# Altium schematic sheet HBridgeControl.SchDoc: Sensorless BLDC interface
size A4; DocumentNumber: 1; Revision: 2; SheetNumber: 1; SheetTotal: 2
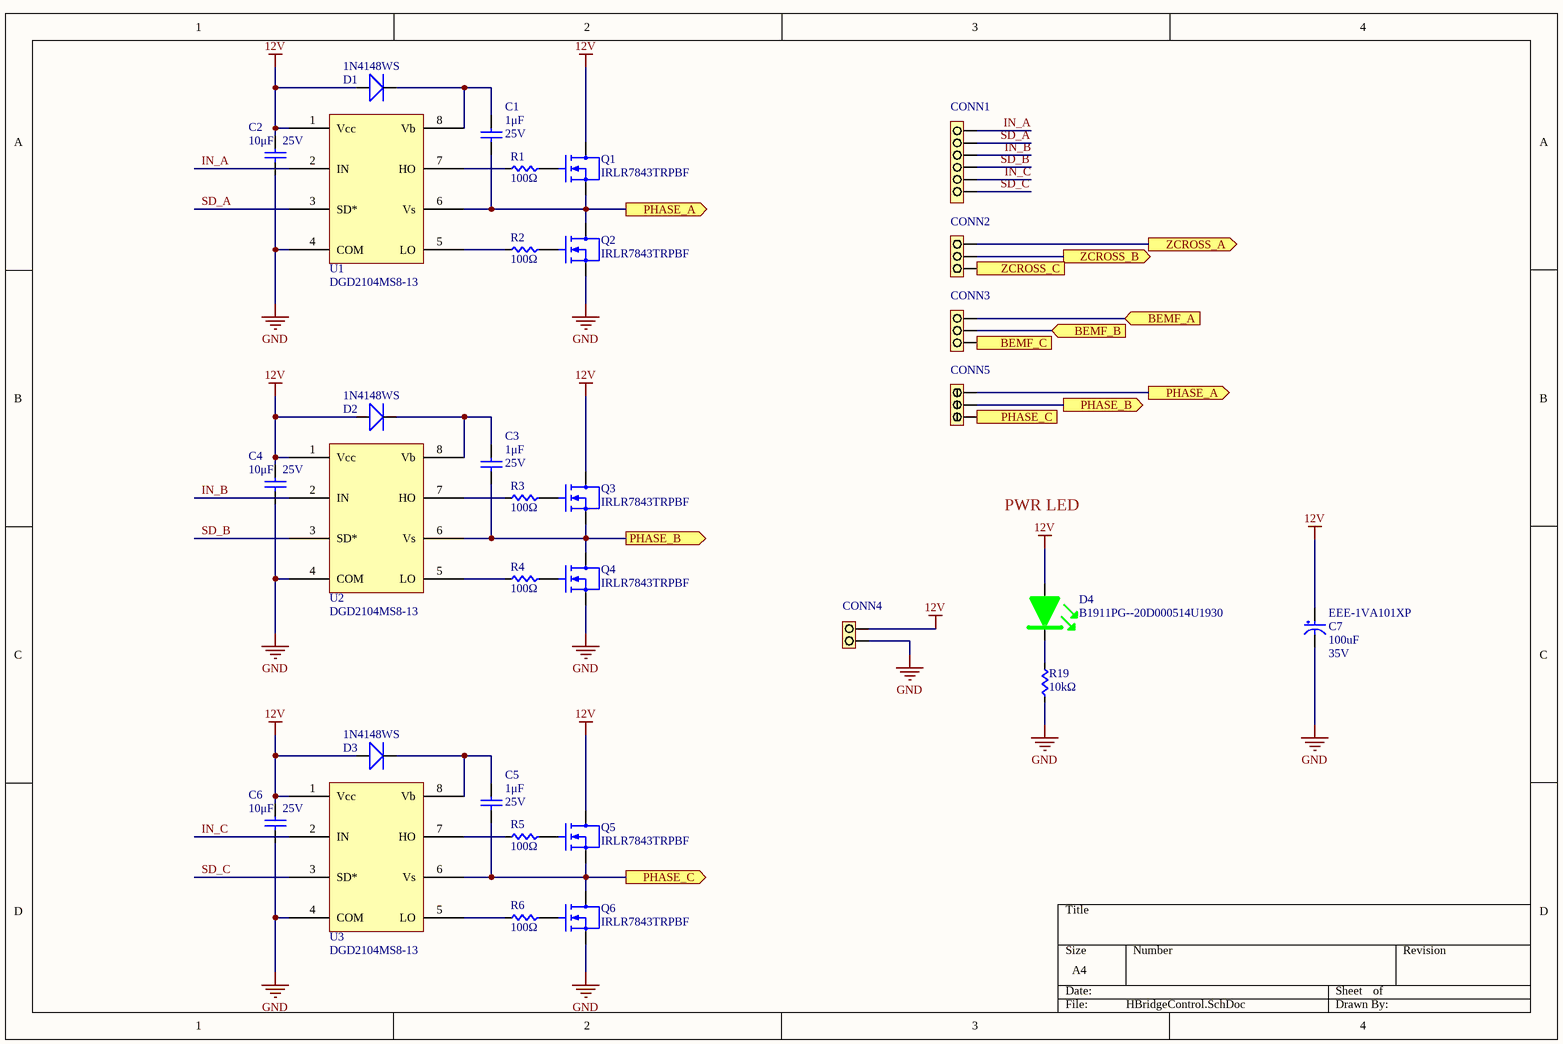
[diagram p0: HBridgeControl.SchDoc]

## Parts
C1  value 1μF  Voltage Rating: 25V  [CAP0603]  (hidden comment: GCM188R71E105KA64D)
C2  value 10μF  Voltage Rating: 25V  [CAP0603]  (hidden comment: GRM188R61E106MA73J)
C3  value 1μF  Voltage Rating: 25V  [CAP0603]  (hidden comment: GCM188R71E105KA64D)
C4  value 10μF  Voltage Rating: 25V  [CAP0603]  (hidden comment: GRM188R61E106MA73J)
C5  value 1μF  Voltage Rating: 25V  [CAP0603]  (hidden comment: GCM188R71E105KA64D)
C6  value 10μF  Voltage Rating: 25V  [CAP0603]  (hidden comment: GRM188R61E106MA73J)
C7  EEE-1VA101XP  Capacitance: 100uF  Voltage Rating: 35V  [SMD]
CONN1  MALE6PINCONN  [6POS HEADER]  (value not drawn)
CONN2  MALE3PINCONN  [3POS HEADER]  (value not drawn)
CONN3  MALE3PINCONN  [3POS HEADER]  (value not drawn)
CONN4  MALE2PINCONN  [2POS HEADER]  (value not drawn)
CONN5  SCREW3PINCONN  [SCREW3POSCONN]  (value not drawn)
D1  1N4148WS  [SOD_323]
D2  1N4148WS  [SOD_323]
D3  1N4148WS  [SOD_323]
D4  B1911PG--20D000514U1930  [LED0603]
Q1  IRLR7843TRPBF  [TO-252AA (DPAK)]
Q2  IRLR7843TRPBF  [TO-252AA (DPAK)]
Q3  IRLR7843TRPBF  [TO-252AA (DPAK)]
Q4  IRLR7843TRPBF  [TO-252AA (DPAK)]
Q5  IRLR7843TRPBF  [TO-252AA (DPAK)]
Q6  IRLR7843TRPBF  [TO-252AA (DPAK)]
R1  value 100Ω  [RES0603]  (hidden comment: RC0402JR-0710KL_1)
R2  value 100Ω  [RES0603]  (hidden comment: RC0402JR-0710KL_1)
R3  value 100Ω  [RES0603]  (hidden comment: RC0402JR-0710KL_1)
R4  value 100Ω  [RES0603]  (hidden comment: RC0402JR-0710KL_1)
R5  value 100Ω  [RES0603]  (hidden comment: RC0402JR-0710KL_1)
R6  value 100Ω  [RES0603]  (hidden comment: RC0402JR-0710KL_1)
R19  value 10kΩ  [RES0402]  (hidden comment: RC0402JR-0710KL)
U1  DGD2104MS8-13  [8SO]
U2  DGD2104MS8-13  [8SO]
U3  DGD2104MS8-13  [8SO]

## Ports
BEMF_A (in, see ZeroCrossDetection[2C]), BEMF_B (in, see ZeroCrossDetection[2C]), BEMF_C (in, see ZeroCrossDetection[2C]), PHASE_A (out, see HBridgeControl[2A], ZeroCrossDetection[1A]), PHASE_A (out, see HBridgeControl[3B], ZeroCrossDetection[1A]), PHASE_B (out, see HBridgeControl[2C], ZeroCrossDetection[1B]), PHASE_B (out, see HBridgeControl[3B], ZeroCrossDetection[1B]), PHASE_C (out, see HBridgeControl[2D], ZeroCrossDetection[1B]), PHASE_C (out, see HBridgeControl[3B], ZeroCrossDetection[1B]), ZCROSS_A (out, see ZeroCrossDetection[4A]), ZCROSS_B (out, see ZeroCrossDetection[4B]), ZCROSS_C (out, see ZeroCrossDetection[4B])

## Nets
12V: C2.1 C4.1 C6.1 C7.1 CONN4.1 D1.1 D2.1 D3.1 D4.1 Q1.2 Q3.2 Q5.2 U1.1(Vcc) U2.1(Vcc) U3.1(Vcc)
GND: C2.2 C4.2 C6.2 C7.2 CONN4.2 Q2.3 Q4.3 Q6.3 R19.2 U1.4(COM) U2.4(COM) U3.4(COM)
BEMF_A: CONN3.1 ; port BEMF_A
BEMF_B: CONN3.2 ; port BEMF_B
BEMF_C: CONN3.3 ; port BEMF_C
IN_A: CONN1.1 U1.2(IN)
IN_B: CONN1.3 U2.2(IN)
IN_C: CONN1.5 U3.2(IN)
PHASE_A: C1.2 CONN5.1 Q1.3 Q2.2 U1.6(Vs) ; port PHASE_A
PHASE_B: C3.2 CONN5.2 Q3.3 Q4.2 U2.6(Vs) ; port PHASE_B
PHASE_C: C5.2 CONN5.3 Q5.3 Q6.2 U3.6(Vs) ; port PHASE_C
SD_A: CONN1.2 U1.3(SD*)
SD_B: CONN1.4 U2.3(SD*)
SD_C: CONN1.6 U3.3(SD*)
ZCROSS_A: CONN2.1 ; port ZCROSS_A
ZCROSS_B: CONN2.2 ; port ZCROSS_B
ZCROSS_C: CONN2.3 ; port ZCROSS_C
NetC1_1: C1.1 D1.2 U1.8(Vb)
NetC3_1: C3.1 D2.2 U2.8(Vb)
NetC5_1: C5.1 D3.2 U3.8(Vb)
NetD4_2: D4.2 R19.1
NetQ1_1: Q1.1 R1.2
NetQ2_1: Q2.1 R2.2
NetQ3_1: Q3.1 R3.2
NetQ4_1: Q4.1 R4.2
NetQ5_1: Q5.1 R5.2
NetQ6_1: Q6.1 R6.2
NetR1_1: R1.1 U1.7(HO)
NetR2_1: R2.1 U1.5(LO)
NetR3_1: R3.1 U2.7(HO)
NetR4_1: R4.1 U2.5(LO)
NetR5_1: R5.1 U3.7(HO)
NetR6_1: R6.1 U3.5(LO)

## Notes on the sheet
- PWR LED

## Library data of the parts
C1 C3 C5 = GCM188R71E105KA64D: CAP CER 1UF 25V X7R 0603; Manufacturer 1: Murata; Manufacturer Part Number 1: GCM21BR71E105KA56L; Supplier 1: Digi-Key; Supplier Part Number 1: 490-4785-1-ND
C2 C4 C6 = GRM188R61E106MA73J: CAP CER 10UF 25V X5R 0603; Manufacturer 1: Murata; Manufacturer Part Number 1: GCM21BR71E105KA56L; Supplier 1: Digi-Key; Supplier Part Number 1: 490-4785-1-ND
C7 = EEE-1VA101XP: CAP ALUM 100UF 20% 35V SMD
D1-D3 = 1N4148WS: DIODE GEN PURP 75V 150MA SOD323F; Manufacturer: Onsemi; Manufacturer Part Number: 1N4148WS; Supplier: DigiKey; Supplier Part Number: 1N4148WSFSTR-ND
D4 = B1911PG--20D000514U1930: LED GREEN DIFFUSED 0603 SMD
Q1-Q6 = IRLR7843TRPBF: N-Channel 30 V 161A (Tc) 140W (Tc) Surface Mount TO-252AA (DPAK); Manufacturer: Infineon Technologies; Manufacturer Part Number: IRLR7843TRPBF; Supplier: DigiKey; Supplier Part Number: IIRLR7843PBFTR-ND
R1-R6 = RC0402JR-0710KL_1: RES 100 OHM 1% 1/10W 0603; Manufacturer 1: Stackpole Electronics Inc; Manufacturer Part Number 1: RNCP0603FTD10K0; Power Rating: 1/8W; Supplier Part Number 1: RNCP0603FTD10K0CT-ND; Supplier 1: Digi-Key
R19 = RC0402JR-0710KL: RES 10K OHM 5% 1/16W 0402; Manufacturer 1: Stackpole Electronics Inc; Manufacturer Part Number 1: RNCP0603FTD10K0; Power Rating: 1/8W; Supplier Part Number 1: RNCP0603FTD10K0CT-ND; Supplier 1: Digi-Key
U1-U3 = DGD2104MS8-13: IC GATE DRVR HALF-BRIDGE 8-SO; Manufacturer: Diodes Incorporated; Manufacturer Part Number: DGD2104MS8-13; Supplier: DigiKey; Supplier Part Number: DGD2104MS8-13DITR-ND